# EAGLE schematic FFChkMate (EAGLE 6.6.0)
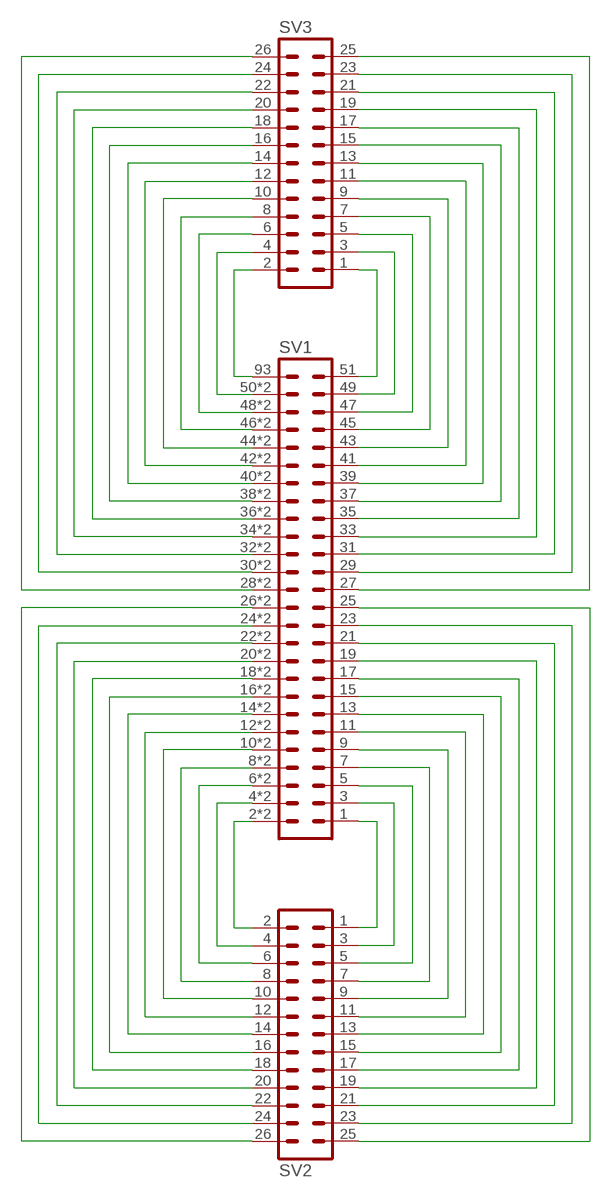
[diagram p0: schematic, sheet 1]

## Parts
SV1  03MM  [03MM]
SV2  MA13-2  [MA13-2]
SV3  MA13-2  [MA13-2]

## Nets
N$1: SV1.1 SV2.1
N$2: SV1.3 SV2.3
N$3: SV1.5 SV2.5
N$4: SV1.7 SV2.7
N$5: SV1.9 SV2.9
N$6: SV1.11 SV2.11
N$7: SV1.13 SV2.13
N$8: SV1.15 SV2.15
N$9: SV1.17 SV2.17
N$10: SV1.19 SV2.19
N$11: SV1.21 SV2.21
N$12: SV1.23 SV2.23
N$13: SV1.25 SV2.25
N$14: SV1.2 SV1.68 SV2.2
N$15: SV1.4 SV1.69 SV2.4
N$16: SV1.6 SV1.70 SV2.6
N$17: SV1.8 SV1.71 SV2.8
N$18: SV1.10 SV1.72 SV2.10
N$19: SV1.12 SV1.73 SV2.12
N$20: SV1.14 SV1.74 SV2.14
N$21: SV1.16 SV1.75 SV2.16
N$22: SV1.18 SV1.76 SV2.18
N$23: SV1.20 SV1.77 SV2.20
N$24: SV1.22 SV1.78 SV2.22
N$25: SV1.24 SV1.79 SV2.24
N$26: SV1.26 SV1.80 SV2.26
N$27: SV1.51 SV3.1
N$28: SV1.49 SV3.3
N$29: SV1.47 SV3.5
N$30: SV1.45 SV3.7
N$31: SV1.43 SV3.9
N$32: SV1.41 SV3.11
N$33: SV1.39 SV3.13
N$34: SV1.37 SV3.15
N$35: SV1.35 SV3.17
N$36: SV1.33 SV3.19
N$37: SV1.31 SV3.21
N$38: SV1.29 SV3.23
N$39: SV1.27 SV3.25
N$40: SV1.93 SV3.2
N$41: SV1.50 SV1.92 SV3.4
N$42: SV1.48 SV1.91 SV3.6
N$43: SV1.46 SV1.90 SV3.8
N$44: SV1.44 SV1.89 SV3.10
N$45: SV1.42 SV1.88 SV3.12
N$46: SV1.40 SV1.87 SV3.14
N$47: SV1.38 SV1.86 SV3.16
N$48: SV1.36 SV1.85 SV3.18
N$49: SV1.34 SV1.84 SV3.20
N$50: SV1.32 SV1.83 SV3.22
N$51: SV1.30 SV1.82 SV3.24
N$52: SV1.28 SV1.81 SV3.26

## Library data of the parts
SV1 = FFChkMate:03MM: PIN HEADER
SV2 SV3 = con-lstb:MA13-2: PIN HEADER; OC_FARNELL: unknown; OC_NEWARK: unknown